# Altium schematic sheet SOURCE_POWER.SchDoc
size A3; SheetNumber: 5; SheetTotal: 10
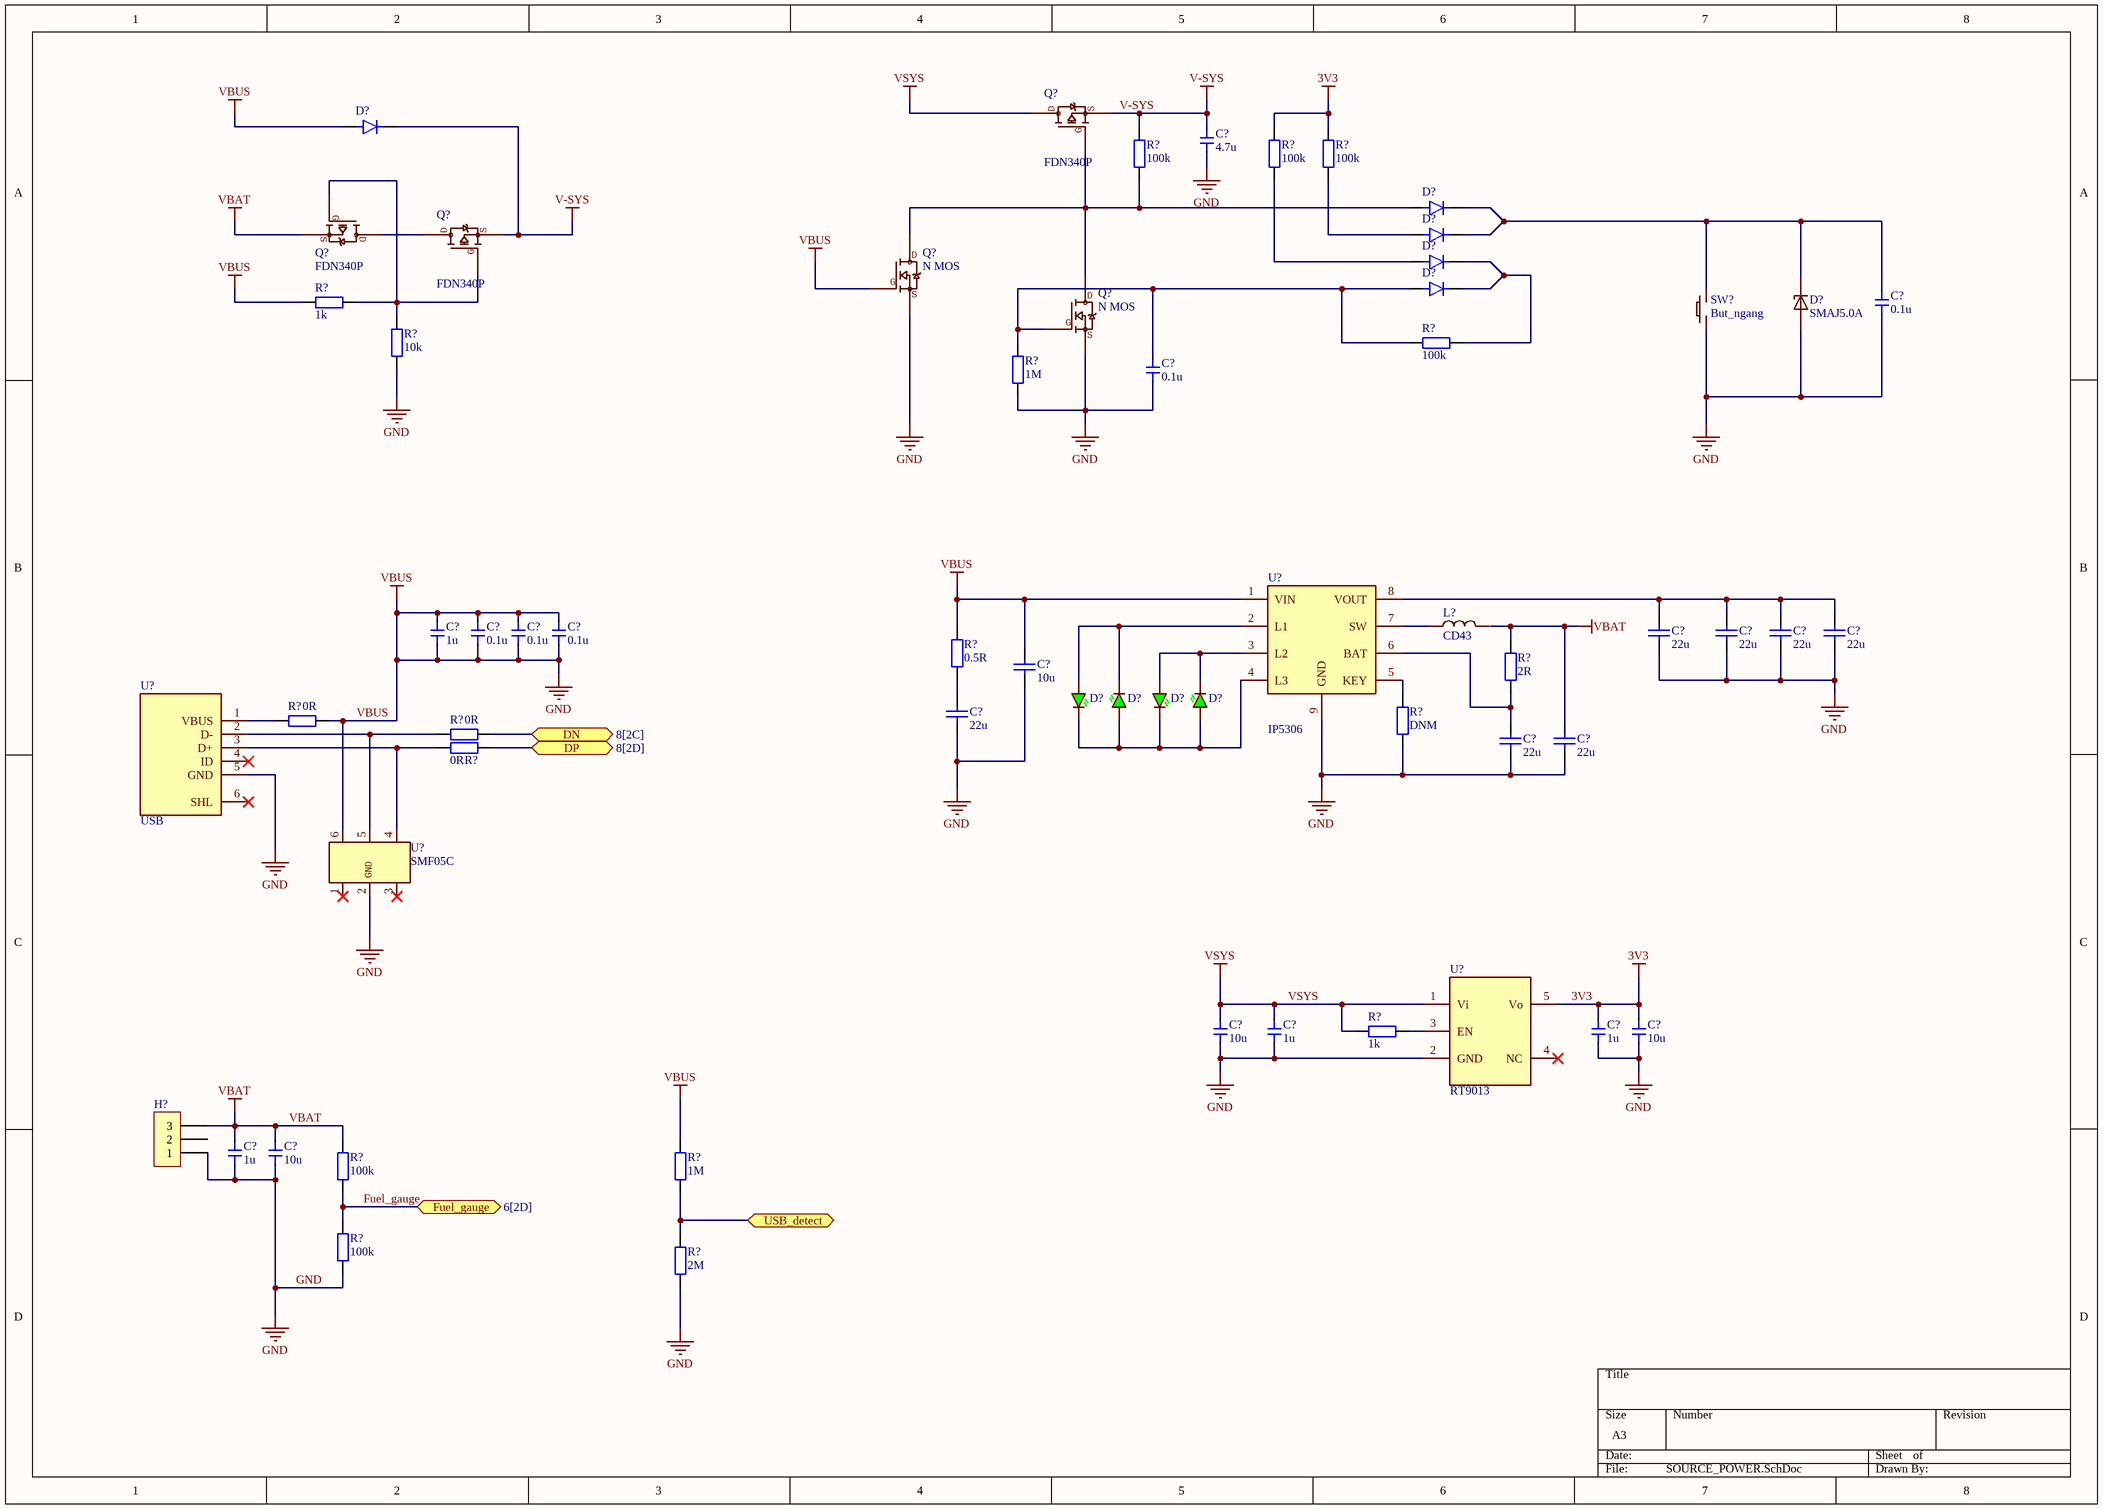
[diagram p0: SOURCE_POWER.SchDoc]

## Parts
(Parts that share a designator on the sheet are numbered #1, #2 ... from top to bottom, then left to right.)
C?#1  4.7u  [Cap 0603]
C?#2  0.1u  [Cap 0603]
C?#3  0.1u  [Cap 0603]
C?#4  22u  [tu 0805]
C?#5  22u  [tu 0805]
C?#6  22u  [tu 0805]
C?#7  22u  [tu 0805]
C?#8  1u  [Cap 0603]
C?#9  0.1u  [Cap 0603]
C?#10  0.1u  [Cap 0603]
C?#11  0.1u  [Cap 0603]
C?#12  10u  [tu 0805]
C?#13  22u  [tu 0805]
C?#14  22u  [tu 0805]
C?#15  22u  [tu 0805]
C?#16  10u  [Cap 0603]
C?#17  1u  [Cap 0603]
C?#18  1u  [Cap 0603]
C?#19  10u  [Cap 0603]
C?#20  1u  [Cap 0603]
C?#21  10u  [Cap 0603]
D?#1  LL4148  [DIO_LL4148]  (value not drawn)
D?#2  LL4148  [DIO_LL4148]  (value not drawn)
D?#3  LL4148  [DIO_LL4148]  (value not drawn)
D?#4  LL4148  [DIO_LL4148]  (value not drawn)
D?#5  LL4148  [DIO_LL4148]  (value not drawn)
D?#6  SMAJ5.0A  [DIOM4325X250N]
D?#7  Led 0603  [LED 0603]  (value not drawn)
D?#8  Led 0603  [LED 0603]  (value not drawn)
D?#9  Led 0603  [LED 0603]  (value not drawn)
D?#10  Led 0603  [LED 0603]  (value not drawn)
H?  Header 3P 2.54 Duc Thang  [XH2.54M-3]  (value not drawn)
L?  CD43  [CD43]
Q?#1  FDN340P  [FDN340P]
Q?#2  FDN340P  [FDN340P]
Q?#3  FDN340P  [FDN340P]
Q?#4  N MOS  [FDN340P]
Q?#5  N MOS  [FDN340P]
R?#1  100k  [Tro smd 0603]
R?#2  100k  [Tro smd 0603]
R?#3  100k  [Tro smd 0603]
R?#4  1k  [tro smd 0603]
R?#5  10k  [tro smd 0603]
R?#6  100k  [Tro smd 0603]
R?#7  1M  [Tro smd 0603]
R?#8  0.5R  [tro smd 0603]
R?#9  2R  [tro smd 0603]
R?#10  0R  [tro smd 0603]
R?#11  DNM  [tro smd 0603]
R?#12  0R  [tro smd 0603]
R?#13  0R  [tro smd 0603]
R?#14  1k  [tro smd 0603]
R?#15  100k  [Tro smd 0603]
R?#16  1M  [Tro smd 0603]
R?#17  100k  [Tro smd 0603]
R?#18  2M  [Tro smd 0603]
SW?  But_ngang  [But_ngang]
U?#1  IP5306  [IP5306]
U?#2  USB  [USB]
U?#3  SMF05C  [SOT-363]
U?#4  RT9013  [RT9013]

## Ports
DN (bidir, see 8[2C]), DP (bidir, see 8[2D]), Fuel_gauge (bidir, see 6[2D]), USB_detect (bidir)

## Nets
3V3: C?#18.1 C?#19.1 R?#2.2 R?#3.2 U?#4.5(Vo)
GND: C?#1.2 C?#2.2 C?#3.2 C?#4.2 C?#5.2 C?#6.2 C?#7.2 C?#8.1 C?#8.2 C?#9.1 C?#9.2 C?#10.1 C?#10.2 C?#11.1 C?#11.2 C?#12.1 C?#12.2 C?#13.2 C?#14.2 C?#15.2 C?#16.2 C?#17.2 C?#18.2 C?#19.2 C?#20.2 C?#21.2 D?#1.A D?#6.A H?.1 Q?#4.1(G) Q?#4.2(S) Q?#5.2(S) R?#4.1 R?#5.1 R?#7.1 R?#8.2 R?#10.2 R?#11.1 R?#16.2 R?#17.1 R?#18.1 SW?.1 U?#1.1(VIN) U?#1.9(GND) U?#2.5(GND) U?#3.2(GND) U?#3.6(IN4) U?#4.2(GND)  [also labelled VBUS]
V-SYS: C?#1.1 D?#1.C Q?#1.2(S) Q?#3.2(S) R?#1.2
VBAT: C?#15.1 C?#20.1 C?#21.1 H?.3 Q?#2.2(S) R?#9.2 R?#15.2
VSYS: C?#16.1 C?#17.1 Q?#1.3(D) R?#14.2 U?#4.1(Vi)
DN: R?#12.2 ; port DN
DP: R?#13.2 ; port DP
Fuel_gauge: R?#15.1 R?#17.2 ; port Fuel_gauge
USB_detect: R?#16.1 R?#18.2 ; port USB_detect
NetC?#2_1: C?#2.1 D?#2.C D?#3.C D?#6.C SW?.2
NetC?#3_1: C?#3.1 D?#5.A Q?#5.1(G) R?#6.2 R?#7.2
NetC?#4_1: C?#4.1 C?#5.1 C?#6.1 C?#7.1 U?#1.8(VOUT)
NetC?#13_1: C?#13.1 R?#8.1
NetC?#14_1: C?#14.1 R?#9.1 U?#1.6(BAT)
NetD?#2_A: D?#2.A Q?#1.1(G) Q?#4.3(D) Q?#5.3(D) R?#1.1
NetD?#3_A: D?#3.A R?#3.1
NetD?#4_A: D?#4.A R?#2.1
NetD?#4_C: D?#4.C D?#5.C R?#6.1
NetD?#7_1: D?#7.1 D?#8.2 U?#1.2(L1)
NetD?#7_2: D?#7.2 D?#8.1 D?#9.2 D?#10.1 U?#1.4(L3)
NetD?#9_1: D?#9.1 D?#10.2 U?#1.3(L2)
NetL?_1: L?.1 U?#1.7(SW)
NetQ?#2_1: Q?#2.1(G) Q?#3.1(G) R?#4.2 R?#5.2
NetQ?#2_3: Q?#2.3(D) Q?#3.3(D)
NetR?#10_1: R?#10.1 U?#2.1(VBUS)
NetR?#11_2: R?#11.2 U?#1.5(KEY)
NetR?#12_1: R?#12.1 U?#2.2(D-) U?#3.5(IN4)
NetR?#13_1: R?#13.1 U?#2.3(D+) U?#3.4(IN3)
NetR?#14_1: R?#14.1 U?#4.3(EN)

Not connected (* = marked no-connect by the designer): H? 2; L? 2(10); U?#2 4(ID)* 6(SHL)*; U?#3 1(IN1)* 3(IN2)*; U?#4 4(NC)*

## Library data of the parts
C?#1-C?#3 C?#8-C?#11 C?#16-C?#21 = Cap 0603: Capacitor SMD 0603
C?#4-C?#7 C?#12-C?#15 = Tu 0805 20pF 50V 10%: Dán; Don_Vi: Con; Ten_Linh_Kien: Tụ 0805 20P 10% 50V; So_Chan: 2; Ma_Hang: MH004558; Chung_Loai: Dán; Kieu_Chan: *
D?#1-D?#5 = LL4148: Diode Standard 100 V 300mA Surface Mount SOD-80 MiniMELF; MF: onsemi; SnapEDA_Link: https://www.snapeda.com/parts/LL4148/Onsemi/view-part/?ref=snap; Package: SOD-80-2 ON Semiconductor; Value: *; MP: LL4148; Check_prices: https://www.snapeda.com/parts/LL4148/Onsemi/view-part/?ref=eda
D?#6 = SMAJ5.0A: 13.4V Clamp 174A (8/20Âµs) Ipp Tvs Diode Surface Mount SMA (DO-214AC); MP: SMAJ5.0A-TR; MF: STMicroelectronics; Purchase-URL: https://pricing.snapeda.com/search/part/SMAJ5.0A-TR/?ref=eda; Check_prices: https://www.snapeda.com/parts/SMAJ5.0A-TR/STMicroelectronics/view-part/?ref=eda; Availability: In Stock; Value: *; Price: None; Package: DO-214 STMicroelectronics; SnapEDA_Link: https://www.snapeda.com/parts/SMAJ5.0A-TR/STMicroelectronics/view-part/?ref=snap
H? = Header 3P 2.54 Duc Thang: Cắm; Ten_Linh_Kien: Header 3P XH2.54-3P Đực Thẳng; Don_Vi: Con; Ma_Hang: MH001292; Chung_Loai: Cắm
L? = CD43: https://www.thegioiic.com/cuon-cam-dan-smd-cd43-4532-1r0-1uh-2-7a
Q?#1-Q?#3 = FDN340P: Small Signal Field-Effect Transistor, 2A I(D), 20V, 1-Element, P-Channel, Silicon, Metal-oxide Semiconductor FET; Manufacturer: ON Semiconductor / Fairchild; Package Body Material: Plastic; Number of Elements: 1; Drain-source On Resistance-Max: 70R; Operating Mode: ENHANCEMENT MODE; Power Dissipation-Max (Abs): 500mW; Transistor Application: SWITCHING; Qualification Status: Not Qualified; Supplier 1: Digikey; Supplier Part Number 1: FDN340PCT-ND; Supplier: Digikey; Supplier Part Number: FDN340PCT-ND; Manufacturer Part Number: FDN340P; RoHS: Yes; Category: MOSFETs; Stock: 82276; Pricing: 1=0.46, 10=0.355, 100=0.213, 500=0.1972, 1000=0.1341, 3000=0.12345, 6000=0.11832, 9000=0.10649, 30000=0.10491, 75000=0.0986 (USD); Pins: 3; Package Shape: Rectangular; Transistor Element Material: SILICON; Terminal Finish: Tin; Max Operating Temperature: 150°C; JESD-30 Code: R-PDSO-G3; Moisture Sensitivity Level: 1; Package Style: SMALL OUTLINEMeter; Surface Mount: Yes; Terminal Form: Gull Wing; Terminal Position: DUAL; Polarity/Channel Type: P-CHANNEL; Drain Current-Max (Abs) (ID): 2A; Drain Current-Max (ID): 2A; DS Breakdown Voltage-Min: 20V; FET Technology: METAL-OXIDE SEMICONDUCTOR; JESD-609 Code: e3; Reach SVHC Compliant: Yes; RoHS Compliant: Yes; ComponentLink1URL: https://datasheet.ciiva.com:443/pdfs/VipMasterIC/IC/ONSM/ONSM-S-A0003584711/ONSM-S-A0003584686-1.pdf?src-supplier=IHS+Markit; ComponentLink1Description: https://datasheet.ciiva.com:443/pdfs/VipMasterIC/IC/ONSM/ONSM-S-A0003584711/ONSM-S-A0003584686-1.pdf?src-supplier=IHS+Markit
Q?#4 Q?#5 = LN2302LT1G: https://www.thegioiic.com/ln2302lt1g-mosfet-kenh-n-20v-2-3a-sot-23-3
R?#1-R?#3 R?#6 R?#7 R?#15-R?#18 = Tro 0603 1% 33k: Dán; Don_Vi: Con; So_Chan: 2; Ten_Linh_Kien: Trở 0603 1% 33k; Ma_Hang: MH006335; Chung_Loai: Dán; Kieu_Chan: *
R?#4 = Tro 0603 1% 1k: Dán; So_Chan: 2; Don_Vi: Con; Ten_Linh_Kien: Trở 0603 1% 1k; Ma_Hang: MH006334; Chung_Loai: Dán; Kieu_Chan: *
R?#5 = Tro 0603 1% 10k: Dán; Don_Vi: Con; So_Chan: 2; Ten_Linh_Kien: Trở 0603 1% 10k; Ma_Hang: MH006333; Chung_Loai: Dán; Kieu_Chan: *
R?#8 R?#9 R?#11 R?#14 = Tro 0603 1% 1R: Dán; Don_Vi: Con; So_Chan: 2; Ten_Linh_Kien: Trở 0603 1% 1R; Ma_Hang: MH007007; Chung_Loai: Dán; Kieu_Chan: *
R?#10 R?#12 R?#13 = Tro 0603 1% 0R: Dán; Don_Vi: Con; So_Chan: 2; Ten_Linh_Kien: Trở 0603 1% 0R; Ma_Hang: MH005792; Chung_Loai: Dán; Kieu_Chan: *
SW? = But_ngang: https://www.thegioiic.com/nut-nhan-3x6mm-cao-3-5mm-4-chan-smd-chinh-ngang
U?#2 = usb: https://www.thegioiic.com/cong-usb-micro-b-2-0-dau-cai-5-chan-smd-v1
U?#3 = SMF05C: https://www.thegioiic.com/products?search=smf05